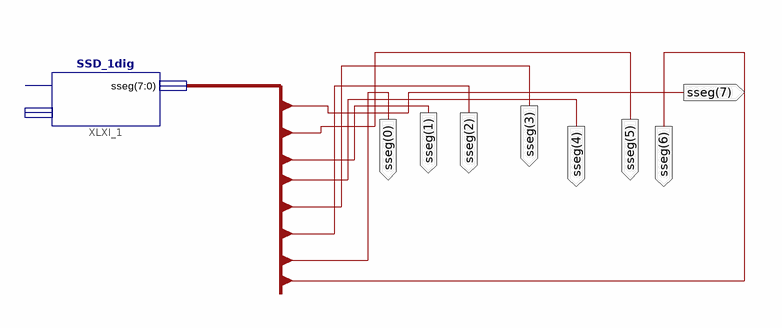
[diagram p0: schematic sheet 1]
// Xilinx ISE schematic reexperiment1.sch (spartan3e) as structural Verilog: 1 symbols, 8 ports
module reexperiment1 (
  output [7:0] sseg
);

  SSD_1dig XLXI_1 (.sseg(sseg));  // open: dp_in, hexD
endmodule
